# EAGLE design 16x16 (EAGLE 6.6.0)
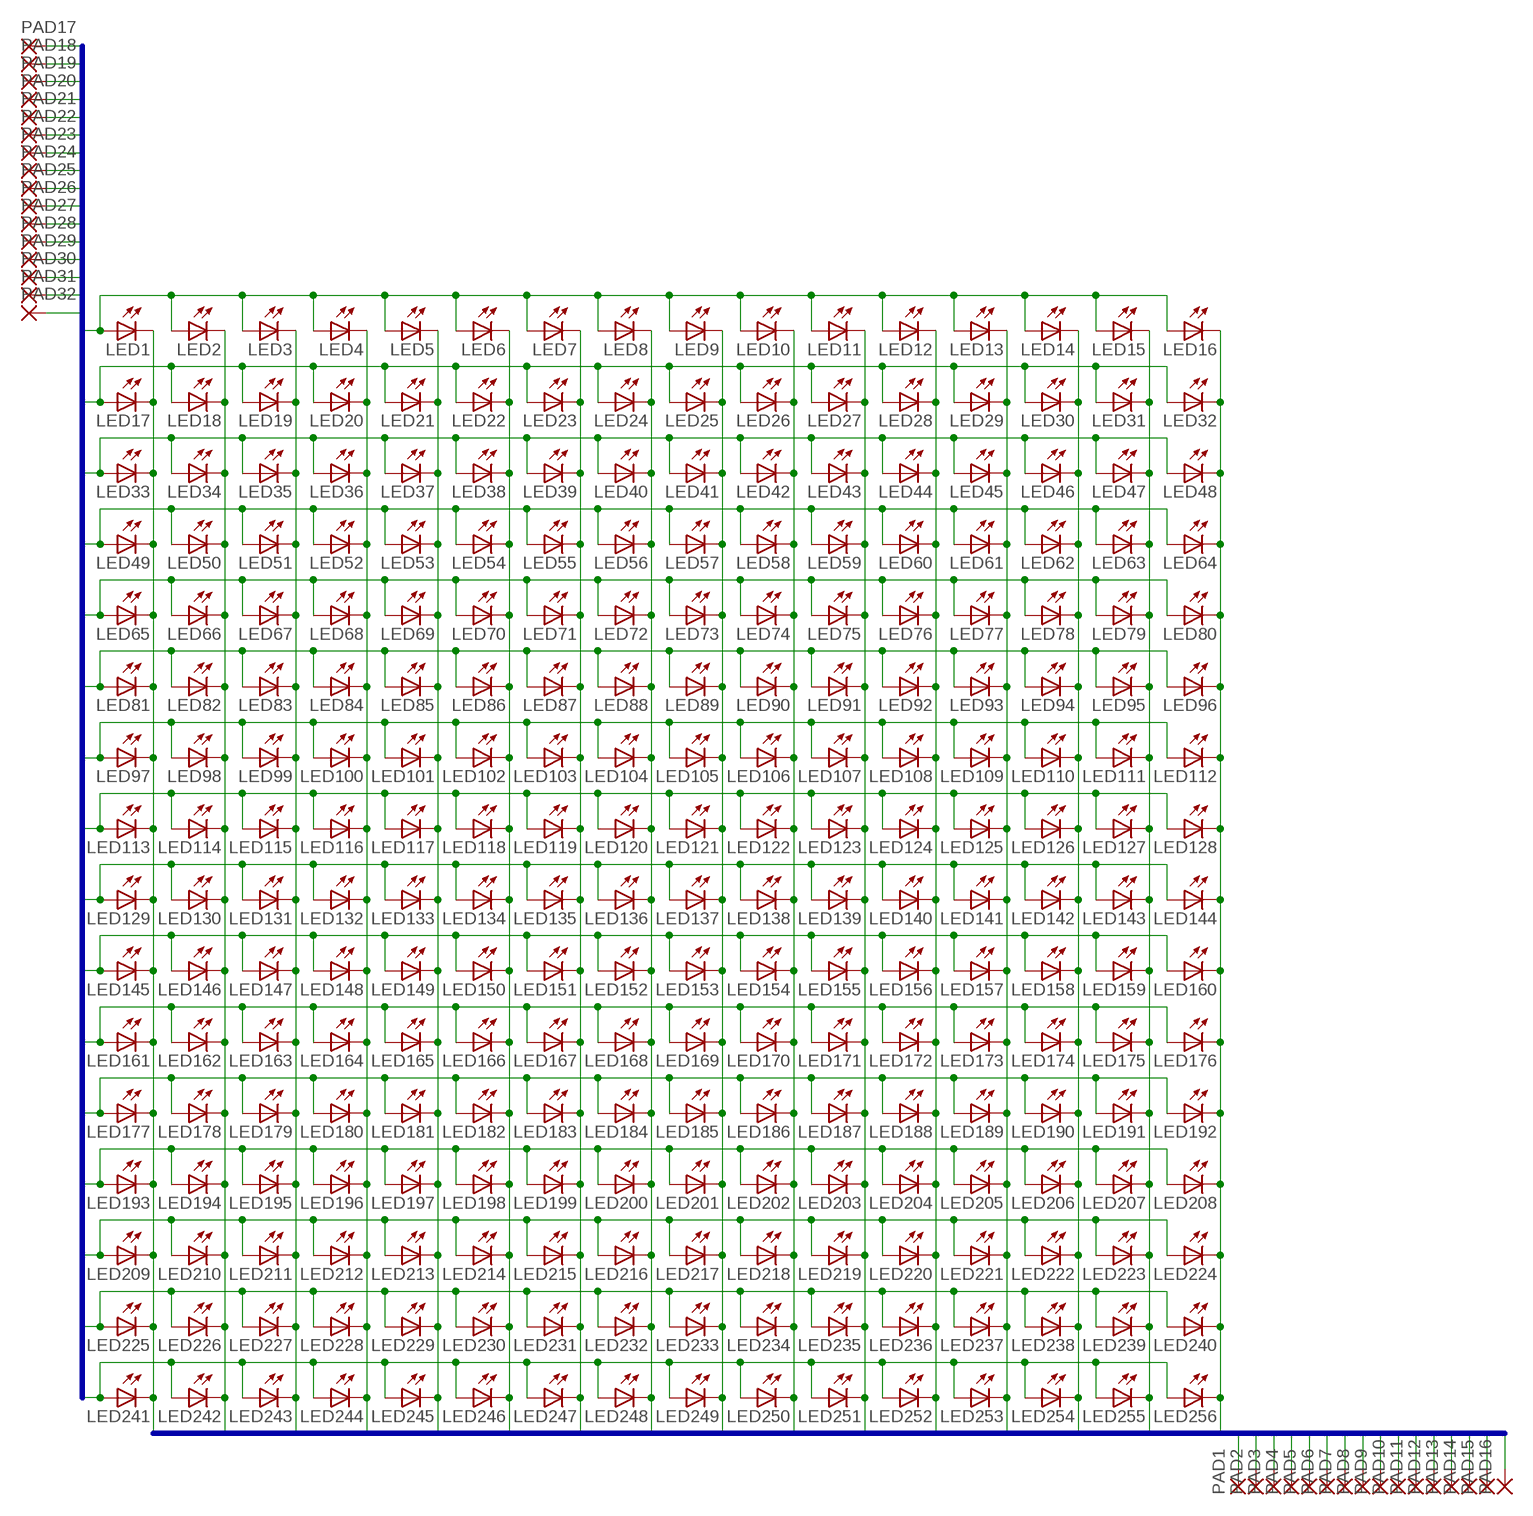
[diagram p0: schematic, sheet 1]

## Parts
LED1  LEDSML0603  [SML0603]
LED2  LEDSML0603  [SML0603]
LED3  LEDSML0603  [SML0603]
LED4  LEDSML0603  [SML0603]
LED5  LEDSML0603  [SML0603]
LED6  LEDSML0603  [SML0603]
LED7  LEDSML0603  [SML0603]
LED8  LEDSML0603  [SML0603]
LED9  LEDSML0603  [SML0603]
LED10  LEDSML0603  [SML0603]
LED11  LEDSML0603  [SML0603]
LED12  LEDSML0603  [SML0603]
LED13  LEDSML0603  [SML0603]
LED14  LEDSML0603  [SML0603]
LED15  LEDSML0603  [SML0603]
LED16  LEDSML0603  [SML0603]
LED17  LEDSML0603  [SML0603]
LED18  LEDSML0603  [SML0603]
LED19  LEDSML0603  [SML0603]
LED20  LEDSML0603  [SML0603]
LED21  LEDSML0603  [SML0603]
LED22  LEDSML0603  [SML0603]
LED23  LEDSML0603  [SML0603]
LED24  LEDSML0603  [SML0603]
LED25  LEDSML0603  [SML0603]
LED26  LEDSML0603  [SML0603]
LED27  LEDSML0603  [SML0603]
LED28  LEDSML0603  [SML0603]
LED29  LEDSML0603  [SML0603]
LED30  LEDSML0603  [SML0603]
LED31  LEDSML0603  [SML0603]
LED32  LEDSML0603  [SML0603]
LED33  LEDSML0603  [SML0603]
LED34  LEDSML0603  [SML0603]
LED35  LEDSML0603  [SML0603]
LED36  LEDSML0603  [SML0603]
LED37  LEDSML0603  [SML0603]
LED38  LEDSML0603  [SML0603]
LED39  LEDSML0603  [SML0603]
LED40  LEDSML0603  [SML0603]
LED41  LEDSML0603  [SML0603]
LED42  LEDSML0603  [SML0603]
LED43  LEDSML0603  [SML0603]
LED44  LEDSML0603  [SML0603]
LED45  LEDSML0603  [SML0603]
LED46  LEDSML0603  [SML0603]
LED47  LEDSML0603  [SML0603]
LED48  LEDSML0603  [SML0603]
LED49  LEDSML0603  [SML0603]
LED50  LEDSML0603  [SML0603]
LED51  LEDSML0603  [SML0603]
LED52  LEDSML0603  [SML0603]
LED53  LEDSML0603  [SML0603]
LED54  LEDSML0603  [SML0603]
LED55  LEDSML0603  [SML0603]
LED56  LEDSML0603  [SML0603]
LED57  LEDSML0603  [SML0603]
LED58  LEDSML0603  [SML0603]
LED59  LEDSML0603  [SML0603]
LED60  LEDSML0603  [SML0603]
LED61  LEDSML0603  [SML0603]
LED62  LEDSML0603  [SML0603]
LED63  LEDSML0603  [SML0603]
LED64  LEDSML0603  [SML0603]
LED65  LEDSML0603  [SML0603]
LED66  LEDSML0603  [SML0603]
LED67  LEDSML0603  [SML0603]
LED68  LEDSML0603  [SML0603]
LED69  LEDSML0603  [SML0603]
LED70  LEDSML0603  [SML0603]
LED71  LEDSML0603  [SML0603]
LED72  LEDSML0603  [SML0603]
LED73  LEDSML0603  [SML0603]
LED74  LEDSML0603  [SML0603]
LED75  LEDSML0603  [SML0603]
LED76  LEDSML0603  [SML0603]
LED77  LEDSML0603  [SML0603]
LED78  LEDSML0603  [SML0603]
LED79  LEDSML0603  [SML0603]
LED80  LEDSML0603  [SML0603]
LED81  LEDSML0603  [SML0603]
LED82  LEDSML0603  [SML0603]
LED83  LEDSML0603  [SML0603]
LED84  LEDSML0603  [SML0603]
LED85  LEDSML0603  [SML0603]
LED86  LEDSML0603  [SML0603]
LED87  LEDSML0603  [SML0603]
LED88  LEDSML0603  [SML0603]
LED89  LEDSML0603  [SML0603]
LED90  LEDSML0603  [SML0603]
LED91  LEDSML0603  [SML0603]
LED92  LEDSML0603  [SML0603]
LED93  LEDSML0603  [SML0603]
LED94  LEDSML0603  [SML0603]
LED95  LEDSML0603  [SML0603]
LED96  LEDSML0603  [SML0603]
LED97  LEDSML0603  [SML0603]
LED98  LEDSML0603  [SML0603]
LED99  LEDSML0603  [SML0603]
LED100  LEDSML0603  [SML0603]
LED101  LEDSML0603  [SML0603]
LED102  LEDSML0603  [SML0603]
LED103  LEDSML0603  [SML0603]
LED104  LEDSML0603  [SML0603]
LED105  LEDSML0603  [SML0603]
LED106  LEDSML0603  [SML0603]
LED107  LEDSML0603  [SML0603]
LED108  LEDSML0603  [SML0603]
LED109  LEDSML0603  [SML0603]
LED110  LEDSML0603  [SML0603]
LED111  LEDSML0603  [SML0603]
LED112  LEDSML0603  [SML0603]
LED113  LEDSML0603  [SML0603]
LED114  LEDSML0603  [SML0603]
LED115  LEDSML0603  [SML0603]
LED116  LEDSML0603  [SML0603]
LED117  LEDSML0603  [SML0603]
LED118  LEDSML0603  [SML0603]
LED119  LEDSML0603  [SML0603]
LED120  LEDSML0603  [SML0603]
LED121  LEDSML0603  [SML0603]
LED122  LEDSML0603  [SML0603]
LED123  LEDSML0603  [SML0603]
LED124  LEDSML0603  [SML0603]
LED125  LEDSML0603  [SML0603]
LED126  LEDSML0603  [SML0603]
LED127  LEDSML0603  [SML0603]
LED128  LEDSML0603  [SML0603]
LED129  LEDSML0603  [SML0603]
LED130  LEDSML0603  [SML0603]
LED131  LEDSML0603  [SML0603]
LED132  LEDSML0603  [SML0603]
LED133  LEDSML0603  [SML0603]
LED134  LEDSML0603  [SML0603]
LED135  LEDSML0603  [SML0603]
LED136  LEDSML0603  [SML0603]
LED137  LEDSML0603  [SML0603]
LED138  LEDSML0603  [SML0603]
LED139  LEDSML0603  [SML0603]
LED140  LEDSML0603  [SML0603]
LED141  LEDSML0603  [SML0603]
LED142  LEDSML0603  [SML0603]
LED143  LEDSML0603  [SML0603]
LED144  LEDSML0603  [SML0603]
LED145  LEDSML0603  [SML0603]
LED146  LEDSML0603  [SML0603]
LED147  LEDSML0603  [SML0603]
LED148  LEDSML0603  [SML0603]
LED149  LEDSML0603  [SML0603]
LED150  LEDSML0603  [SML0603]
LED151  LEDSML0603  [SML0603]
LED152  LEDSML0603  [SML0603]
LED153  LEDSML0603  [SML0603]
LED154  LEDSML0603  [SML0603]
LED155  LEDSML0603  [SML0603]
LED156  LEDSML0603  [SML0603]
LED157  LEDSML0603  [SML0603]
LED158  LEDSML0603  [SML0603]
LED159  LEDSML0603  [SML0603]
LED160  LEDSML0603  [SML0603]
LED161  LEDSML0603  [SML0603]
LED162  LEDSML0603  [SML0603]
LED163  LEDSML0603  [SML0603]
LED164  LEDSML0603  [SML0603]
LED165  LEDSML0603  [SML0603]
LED166  LEDSML0603  [SML0603]
LED167  LEDSML0603  [SML0603]
LED168  LEDSML0603  [SML0603]
LED169  LEDSML0603  [SML0603]
LED170  LEDSML0603  [SML0603]
LED171  LEDSML0603  [SML0603]
LED172  LEDSML0603  [SML0603]
LED173  LEDSML0603  [SML0603]
LED174  LEDSML0603  [SML0603]
LED175  LEDSML0603  [SML0603]
LED176  LEDSML0603  [SML0603]
LED177  LEDSML0603  [SML0603]
LED178  LEDSML0603  [SML0603]
LED179  LEDSML0603  [SML0603]
LED180  LEDSML0603  [SML0603]
LED181  LEDSML0603  [SML0603]
LED182  LEDSML0603  [SML0603]
LED183  LEDSML0603  [SML0603]
LED184  LEDSML0603  [SML0603]
LED185  LEDSML0603  [SML0603]
LED186  LEDSML0603  [SML0603]
LED187  LEDSML0603  [SML0603]
LED188  LEDSML0603  [SML0603]
LED189  LEDSML0603  [SML0603]
LED190  LEDSML0603  [SML0603]
LED191  LEDSML0603  [SML0603]
LED192  LEDSML0603  [SML0603]
LED193  LEDSML0603  [SML0603]
LED194  LEDSML0603  [SML0603]
LED195  LEDSML0603  [SML0603]
LED196  LEDSML0603  [SML0603]
LED197  LEDSML0603  [SML0603]
LED198  LEDSML0603  [SML0603]
LED199  LEDSML0603  [SML0603]
LED200  LEDSML0603  [SML0603]
LED201  LEDSML0603  [SML0603]
LED202  LEDSML0603  [SML0603]
LED203  LEDSML0603  [SML0603]
LED204  LEDSML0603  [SML0603]
LED205  LEDSML0603  [SML0603]
LED206  LEDSML0603  [SML0603]
LED207  LEDSML0603  [SML0603]
LED208  LEDSML0603  [SML0603]
LED209  LEDSML0603  [SML0603]
LED210  LEDSML0603  [SML0603]
LED211  LEDSML0603  [SML0603]
LED212  LEDSML0603  [SML0603]
LED213  LEDSML0603  [SML0603]
LED214  LEDSML0603  [SML0603]
LED215  LEDSML0603  [SML0603]
LED216  LEDSML0603  [SML0603]
LED217  LEDSML0603  [SML0603]
LED218  LEDSML0603  [SML0603]
LED219  LEDSML0603  [SML0603]
LED220  LEDSML0603  [SML0603]
LED221  LEDSML0603  [SML0603]
LED222  LEDSML0603  [SML0603]
LED223  LEDSML0603  [SML0603]
LED224  LEDSML0603  [SML0603]
LED225  LEDSML0603  [SML0603]
LED226  LEDSML0603  [SML0603]
LED227  LEDSML0603  [SML0603]
LED228  LEDSML0603  [SML0603]
LED229  LEDSML0603  [SML0603]
LED230  LEDSML0603  [SML0603]
LED231  LEDSML0603  [SML0603]
LED232  LEDSML0603  [SML0603]
LED233  LEDSML0603  [SML0603]
LED234  LEDSML0603  [SML0603]
LED235  LEDSML0603  [SML0603]
LED236  LEDSML0603  [SML0603]
LED237  LEDSML0603  [SML0603]
LED238  LEDSML0603  [SML0603]
LED239  LEDSML0603  [SML0603]
LED240  LEDSML0603  [SML0603]
LED241  LEDSML0603  [SML0603]
LED242  LEDSML0603  [SML0603]
LED243  LEDSML0603  [SML0603]
LED244  LEDSML0603  [SML0603]
LED245  LEDSML0603  [SML0603]
LED246  LEDSML0603  [SML0603]
LED247  LEDSML0603  [SML0603]
LED248  LEDSML0603  [SML0603]
LED249  LEDSML0603  [SML0603]
LED250  LEDSML0603  [SML0603]
LED251  LEDSML0603  [SML0603]
LED252  LEDSML0603  [SML0603]
LED253  LEDSML0603  [SML0603]
LED254  LEDSML0603  [SML0603]
LED255  LEDSML0603  [SML0603]
LED256  LEDSML0603  [SML0603]
PAD1  SMD2  [SMD1,27-2,54]
PAD2  SMD2  [SMD1,27-2,54]
PAD3  SMD2  [SMD1,27-2,54]
PAD4  SMD2  [SMD1,27-2,54]
PAD5  SMD2  [SMD1,27-2,54]
PAD6  SMD2  [SMD1,27-2,54]
PAD7  SMD2  [SMD1,27-2,54]
PAD8  SMD2  [SMD1,27-2,54]
PAD9  SMD2  [SMD1,27-2,54]
PAD10  SMD2  [SMD1,27-2,54]
PAD11  SMD2  [SMD1,27-2,54]
PAD12  SMD2  [SMD1,27-2,54]
PAD13  SMD2  [SMD1,27-2,54]
PAD14  SMD2  [SMD1,27-2,54]
PAD15  SMD2  [SMD1,27-2,54]
PAD16  SMD2  [SMD1,27-2,54]
PAD17  SMD2  [SMD1,27-2,54]
PAD18  SMD2  [SMD1,27-2,54]
PAD19  SMD2  [SMD1,27-2,54]
PAD20  SMD2  [SMD1,27-2,54]
PAD21  SMD2  [SMD1,27-2,54]
PAD22  SMD2  [SMD1,27-2,54]
PAD23  SMD2  [SMD1,27-2,54]
PAD24  SMD2  [SMD1,27-2,54]
PAD25  SMD2  [SMD1,27-2,54]
PAD26  SMD2  [SMD1,27-2,54]
PAD27  SMD2  [SMD1,27-2,54]
PAD28  SMD2  [SMD1,27-2,54]
PAD29  SMD2  [SMD1,27-2,54]
PAD30  SMD2  [SMD1,27-2,54]
PAD31  SMD2  [SMD1,27-2,54]
PAD32  SMD2  [SMD1,27-2,54]

## Nets
X0: LED1.C LED17.C LED33.C LED49.C LED65.C LED81.C LED97.C LED113.C LED129.C LED145.C LED161.C LED177.C LED193.C LED209.C LED225.C LED241.C PAD1.1(P)
X1: LED2.C LED18.C LED34.C LED50.C LED66.C LED82.C LED98.C LED114.C LED130.C LED146.C LED162.C LED178.C LED194.C LED210.C LED226.C LED242.C PAD2.1(P)
X2: LED3.C LED19.C LED35.C LED51.C LED67.C LED83.C LED99.C LED115.C LED131.C LED147.C LED163.C LED179.C LED195.C LED211.C LED227.C LED243.C PAD3.1(P)
X3: LED4.C LED20.C LED36.C LED52.C LED68.C LED84.C LED100.C LED116.C LED132.C LED148.C LED164.C LED180.C LED196.C LED212.C LED228.C LED244.C PAD4.1(P)
X4: LED5.C LED21.C LED37.C LED53.C LED69.C LED85.C LED101.C LED117.C LED133.C LED149.C LED165.C LED181.C LED197.C LED213.C LED229.C LED245.C PAD5.1(P)
X5: LED6.C LED22.C LED38.C LED54.C LED70.C LED86.C LED102.C LED118.C LED134.C LED150.C LED166.C LED182.C LED198.C LED214.C LED230.C LED246.C PAD6.1(P)
X6: LED7.C LED23.C LED39.C LED55.C LED71.C LED87.C LED103.C LED119.C LED135.C LED151.C LED167.C LED183.C LED199.C LED215.C LED231.C LED247.C PAD7.1(P)
X7: LED8.C LED24.C LED40.C LED56.C LED72.C LED88.C LED104.C LED120.C LED136.C LED152.C LED168.C LED184.C LED200.C LED216.C LED232.C LED248.C PAD8.1(P)
X8: LED9.C LED25.C LED41.C LED57.C LED73.C LED89.C LED105.C LED121.C LED137.C LED153.C LED169.C LED185.C LED201.C LED217.C LED233.C LED249.C PAD9.1(P)
X9: LED10.C LED26.C LED42.C LED58.C LED74.C LED90.C LED106.C LED122.C LED138.C LED154.C LED170.C LED186.C LED202.C LED218.C LED234.C LED250.C PAD10.1(P)
X10: LED11.C LED27.C LED43.C LED59.C LED75.C LED91.C LED107.C LED123.C LED139.C LED155.C LED171.C LED187.C LED203.C LED219.C LED235.C LED251.C PAD11.1(P)
X11: LED12.C LED28.C LED44.C LED60.C LED76.C LED92.C LED108.C LED124.C LED140.C LED156.C LED172.C LED188.C LED204.C LED220.C LED236.C LED252.C PAD12.1(P)
X12: LED13.C LED29.C LED45.C LED61.C LED77.C LED93.C LED109.C LED125.C LED141.C LED157.C LED173.C LED189.C LED205.C LED221.C LED237.C LED253.C PAD13.1(P)
X13: LED14.C LED30.C LED46.C LED62.C LED78.C LED94.C LED110.C LED126.C LED142.C LED158.C LED174.C LED190.C LED206.C LED222.C LED238.C LED254.C PAD14.1(P)
X14: LED15.C LED31.C LED47.C LED63.C LED79.C LED95.C LED111.C LED127.C LED143.C LED159.C LED175.C LED191.C LED207.C LED223.C LED239.C LED255.C PAD15.1(P)
X15: LED16.C LED32.C LED48.C LED64.C LED80.C LED96.C LED112.C LED128.C LED144.C LED160.C LED176.C LED192.C LED208.C LED224.C LED240.C LED256.C PAD16.1(P)
Y0: LED1.A LED2.A LED3.A LED4.A LED5.A LED6.A LED7.A LED8.A LED9.A LED10.A LED11.A LED12.A LED13.A LED14.A LED15.A LED16.A PAD17.1(P)
Y1: LED17.A LED18.A LED19.A LED20.A LED21.A LED22.A LED23.A LED24.A LED25.A LED26.A LED27.A LED28.A LED29.A LED30.A LED31.A LED32.A PAD18.1(P)
Y2: LED33.A LED34.A LED35.A LED36.A LED37.A LED38.A LED39.A LED40.A LED41.A LED42.A LED43.A LED44.A LED45.A LED46.A LED47.A LED48.A PAD19.1(P)
Y3: LED49.A LED50.A LED51.A LED52.A LED53.A LED54.A LED55.A LED56.A LED57.A LED58.A LED59.A LED60.A LED61.A LED62.A LED63.A LED64.A PAD20.1(P)
Y4: LED65.A LED66.A LED67.A LED68.A LED69.A LED70.A LED71.A LED72.A LED73.A LED74.A LED75.A LED76.A LED77.A LED78.A LED79.A LED80.A PAD21.1(P)
Y5: LED81.A LED82.A LED83.A LED84.A LED85.A LED86.A LED87.A LED88.A LED89.A LED90.A LED91.A LED92.A LED93.A LED94.A LED95.A LED96.A PAD22.1(P)
Y6: LED97.A LED98.A LED99.A LED100.A LED101.A LED102.A LED103.A LED104.A LED105.A LED106.A LED107.A LED108.A LED109.A LED110.A LED111.A LED112.A PAD23.1(P)
Y7: LED113.A LED114.A LED115.A LED116.A LED117.A LED118.A LED119.A LED120.A LED121.A LED122.A LED123.A LED124.A LED125.A LED126.A LED127.A LED128.A PAD24.1(P)
Y8: LED129.A LED130.A LED131.A LED132.A LED133.A LED134.A LED135.A LED136.A LED137.A LED138.A LED139.A LED140.A LED141.A LED142.A LED143.A LED144.A PAD25.1(P)
Y9: LED145.A LED146.A LED147.A LED148.A LED149.A LED150.A LED151.A LED152.A LED153.A LED154.A LED155.A LED156.A LED157.A LED158.A LED159.A LED160.A PAD26.1(P)
Y10: LED161.A LED162.A LED163.A LED164.A LED165.A LED166.A LED167.A LED168.A LED169.A LED170.A LED171.A LED172.A LED173.A LED174.A LED175.A LED176.A PAD27.1(P)
Y11: LED177.A LED178.A LED179.A LED180.A LED181.A LED182.A LED183.A LED184.A LED185.A LED186.A LED187.A LED188.A LED189.A LED190.A LED191.A LED192.A PAD28.1(P)
Y12: LED193.A LED194.A LED195.A LED196.A LED197.A LED198.A LED199.A LED200.A LED201.A LED202.A LED203.A LED204.A LED205.A LED206.A LED207.A LED208.A PAD29.1(P)
Y13: LED209.A LED210.A LED211.A LED212.A LED213.A LED214.A LED215.A LED216.A LED217.A LED218.A LED219.A LED220.A LED221.A LED222.A LED223.A LED224.A PAD30.1(P)
Y14: LED225.A LED226.A LED227.A LED228.A LED229.A LED230.A LED231.A LED232.A LED233.A LED234.A LED235.A LED236.A LED237.A LED238.A LED239.A LED240.A PAD31.1(P)
Y15: LED241.A LED242.A LED243.A LED244.A LED245.A LED246.A LED247.A LED248.A LED249.A LED250.A LED251.A LED252.A LED253.A LED254.A LED255.A LED256.A PAD32.1(P)

## Buses
X[0..15]
Y[0..15]

## Library data of the parts
LED1-LED256 = led:LED: LED OSRAM: - CHIPLED LG R971, LG N971, LY N971, LG Q971, LY Q971, LO R971, LY R971 LH N974, LH R974 LS Q976, LO Q976, LY Q976 LO Q996 - Hyper CHIPLED LW Q18S LB Q993, LB Q99A, LB R99A - SideLED LS A670, LO A670, LY A670, LG A670, LP A670 LB A673, LV A673, LT A673, LW A673 LH A674 LY A675 LS A676, LA A676, LO A676, LY A676, LW A676 LS A679, LY A679, LG A679 - Hyper Micro SIDELED® LS Y876, LA Y876, LO Y876, LY Y876 LT Y87S - SmartLED LW L88C, LW L88S LB L89C, LB L89S, LG L890 LS L89K, LO L89K, LY L89K LS L896, LA L896, LO L896, LY L896 - TOPLED LS T670, LO T670, LY T670, LG T670, LP T670 LSG T670, LSP T670, LSY T670, LOP T670, LYG T670 LG T671, LOG T671, LSG T671 LB T673, LV T673, LT T673, LW T673 LH T674 LS T676, LA T676, LO T676, LY T676, LB T676, LH T676, LSB T676, LW T676 LB T67C, LV T67C, LT T67C, LS T67K, LO T67K, LY T67K, LW E67C LS E67B, LA E67B, LO E67B, LY E67B, LB E67C, LV E67C, LT E67C LW T67C LS T679, LY T679, LG T679 LS T770, LO T770, LY T770, LG T770, LP T770 LB T773, LV T773, LT T773, LW T773 LH T774 LS E675, LA E675, LY E675, LS T675 LS T776, LA T776, LO T776, LY T776, LB T776 LHGB T686 LT T68C, LB T68C - Hyper Mini TOPLED® LB M676 - Mini TOPLED Santana® LG M470 LS M47K, LO M47K, LY M47K Source: http://www.osram.convergy.de LUXEON: - LUMILED® LXK2-PW12-R00, LXK2-PW12-S00, LXK2-PW14-U00, LXK2-PW14-V00 LXK2-PM12-R00, LXK2-PM12-S00, LXK2-PM14-U00 LXK2-PE12-Q00, LXK2-PE12-R00, LXK2-PE12-S00, LXK2-PE14-T00, LXK2-PE14-U00 LXK2-PB12-K00, LXK2-PB12-L00, LXK2-PB12-M00, LXK2-PB14-N00, LXK2-PB14-P00, LXK2-PB14-Q00 LXK2-PR12-L00, LXK2-PR12-M00, LXK2-PR14-Q00, LXK2-PR14-R00 LXK2-PD12-Q00, LXK2-PD12-R00, LXK2-PD12-S00 LXK2-PH12-R00, LXK2-PH12-S00 LXK2-PL12-P00, LXK2-PL12-Q00, LXK2-PL12-R00 Source: www.luxeon.com KINGBRIGHT: KA-3528ASYC Source: www.kingbright.com
PAD1-PAD32 = wirepad:SMD2: SMD PAD

## Board
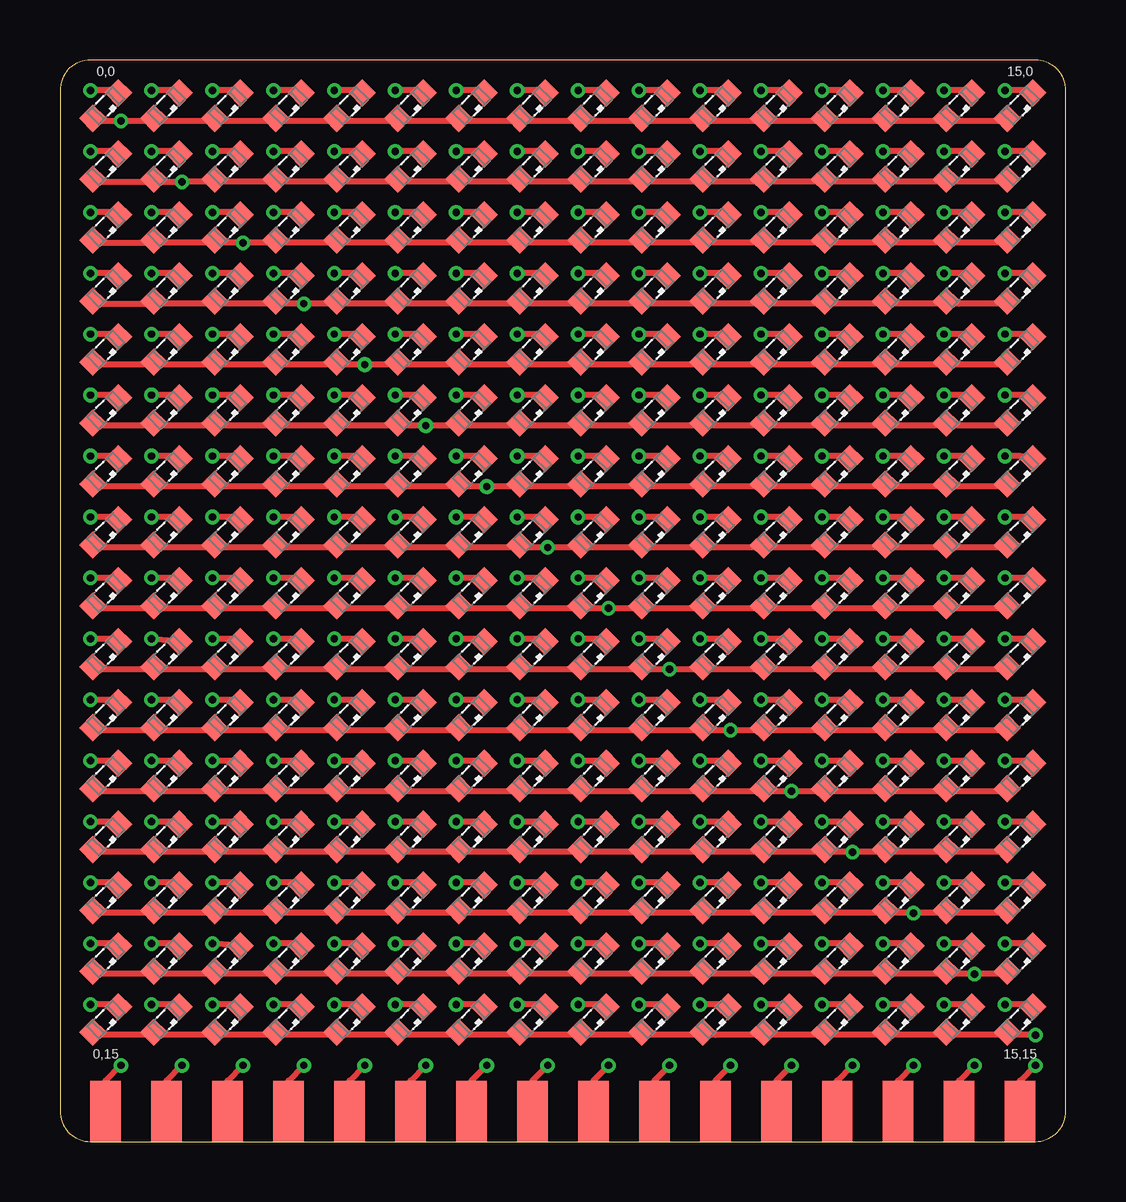
[diagram p1: board, top side]
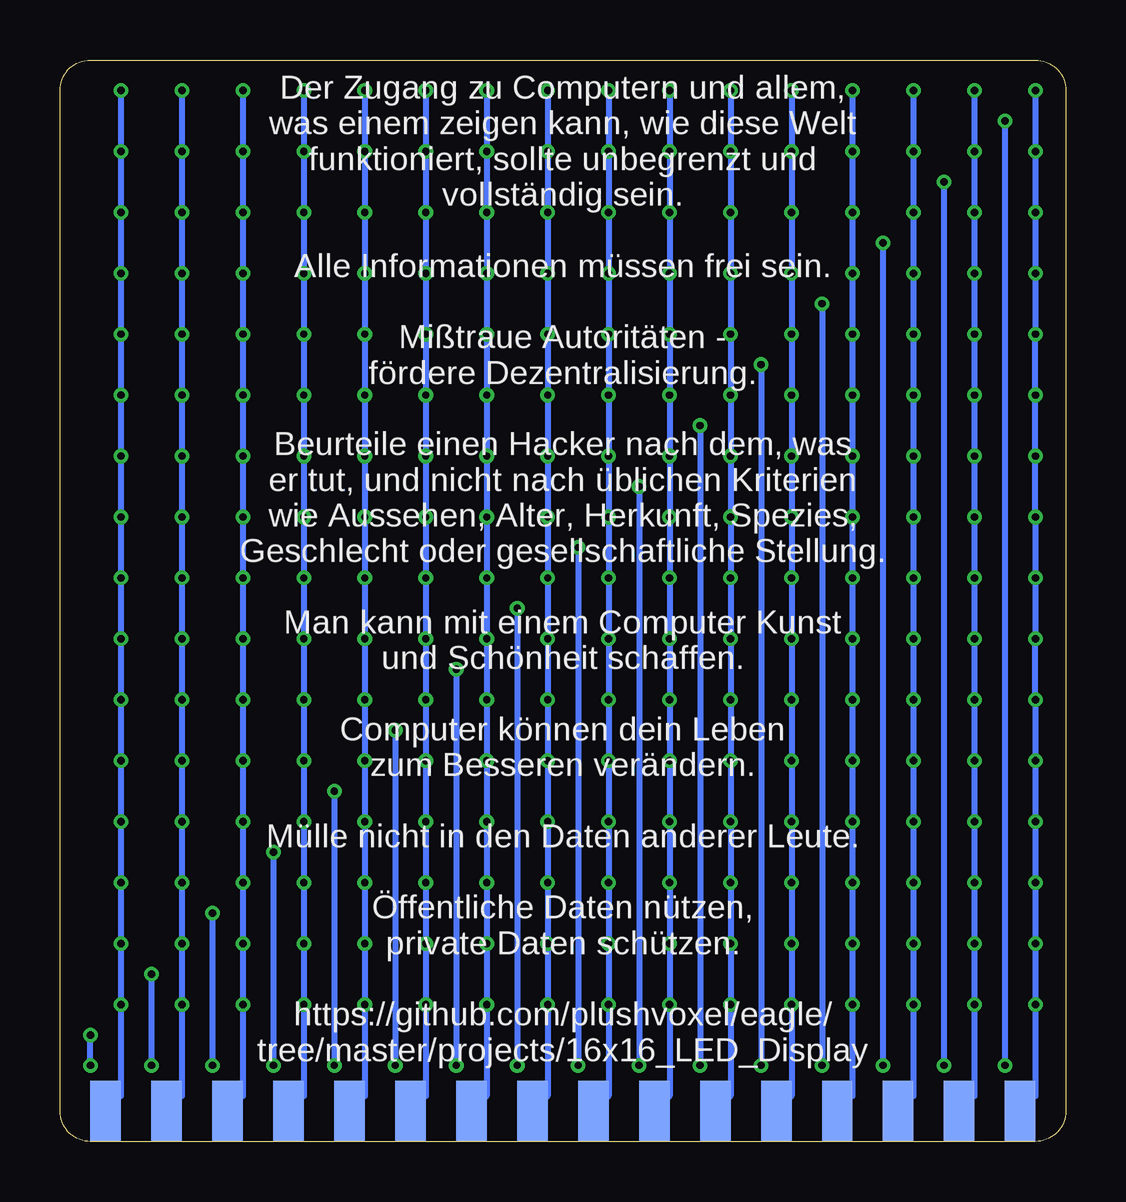
[diagram p2: board, bottom side, seen from below]

Size 41.91 x 45.09 mm. Coordinates in mm from the lower left corner, seen from the top.
Outline: 0,43.81 0,1.27 arc90 1.27,0 40.64,0 arc90 41.91,1.27 41.91,43.81 arc90 40.64,45.09 1.27,45.09 arc90 0,43.81
Copper layers (1*16): Top 0.035mm / dielectric 1.5mm / Bottom 0.035mm
Design rules "dirt_cheap_dirty_boards.v1": minimum track width 5mil, minimum drill 12mil, track to track 5mil, track to pad 5mil, pad to pad 5mil, via to via 5mil, smd to smd 0mil, copper to edge 10mil, drill to drill 10mil, minimum pad ring 10mil, minimum via ring 6mil, stop-mask expansion 2mil, vias tented up to drill 25mil, thermal gap 10mil

### Footprints (pad centres in the part's own frame; a part is rotated, then mirrored left to right if it is on the bottom)
SML0603 = smd 0.8 x 0.8: A 0.75,0; C -0.75,0
SMD1,27-2,54 = smd 1.27 x 2.54: 1 0,0

### Placement (x,y rotation side)
LED1  1.91,43.18 225 top
LED2  4.45,43.18 225 top
LED3  6.99,43.18 225 top
LED4  9.53,43.18 225 top
LED5  12.06,43.18 225 top
LED6  14.61,43.18 225 top
LED7  17.14,43.18 225 top
LED8  19.68,43.18 225 top
LED9  22.23,43.18 225 top
LED10  24.77,43.18 225 top
LED11  27.3,43.18 225 top
LED12  29.84,43.18 225 top
LED13  32.38,43.18 225 top
LED14  34.92,43.18 225 top
LED15  37.47,43.18 225 top
LED16  40.01,43.18 225 top
LED17  1.91,40.64 225 top
LED18  4.45,40.64 225 top
LED19  6.99,40.64 225 top
LED20  9.53,40.64 225 top
LED21  12.06,40.64 225 top
LED22  14.61,40.64 225 top
LED23  17.14,40.64 225 top
LED24  19.68,40.64 225 top
LED25  22.23,40.64 225 top
LED26  24.77,40.64 225 top
LED27  27.3,40.64 225 top
LED28  29.84,40.64 225 top
LED29  32.38,40.64 225 top
LED30  34.92,40.64 225 top
LED31  37.47,40.64 225 top
LED32  40.01,40.64 225 top
LED33  1.91,38.1 225 top
LED34  4.45,38.1 225 top
LED35  6.99,38.1 225 top
LED36  9.53,38.1 225 top
LED37  12.06,38.1 225 top
LED38  14.61,38.1 225 top
LED39  17.14,38.1 225 top
LED40  19.68,38.1 225 top
LED41  22.23,38.1 225 top
LED42  24.77,38.1 225 top
LED43  27.3,38.1 225 top
LED44  29.84,38.1 225 top
LED45  32.38,38.1 225 top
LED46  34.92,38.1 225 top
LED47  37.47,38.1 225 top
LED48  40.01,38.1 225 top
LED49  1.91,35.56 225 top
LED50  4.45,35.56 225 top
LED51  6.99,35.56 225 top
LED52  9.53,35.56 225 top
LED53  12.06,35.56 225 top
LED54  14.61,35.56 225 top
LED55  17.14,35.56 225 top
LED56  19.68,35.56 225 top
LED57  22.23,35.56 225 top
LED58  24.77,35.56 225 top
LED59  27.3,35.56 225 top
LED60  29.84,35.56 225 top
LED61  32.38,35.56 225 top
LED62  34.92,35.56 225 top
LED63  37.47,35.56 225 top
LED64  40.01,35.56 225 top
LED65  1.91,33.02 225 top
LED66  4.45,33.02 225 top
LED67  6.99,33.02 225 top
LED68  9.53,33.02 225 top
LED69  12.06,33.02 225 top
LED70  14.61,33.02 225 top
LED71  17.14,33.02 225 top
LED72  19.68,33.02 225 top
LED73  22.23,33.02 225 top
LED74  24.77,33.02 225 top
LED75  27.3,33.02 225 top
LED76  29.84,33.02 225 top
LED77  32.38,33.02 225 top
LED78  34.92,33.02 225 top
LED79  37.47,33.02 225 top
LED80  40.01,33.02 225 top
LED81  1.91,30.48 225 top
LED82  4.45,30.48 225 top
LED83  6.99,30.48 225 top
LED84  9.53,30.48 225 top
LED85  12.06,30.48 225 top
LED86  14.61,30.48 225 top
LED87  17.14,30.48 225 top
LED88  19.68,30.48 225 top
LED89  22.23,30.48 225 top
LED90  24.77,30.48 225 top
LED91  27.3,30.48 225 top
LED92  29.84,30.48 225 top
LED93  32.38,30.48 225 top
LED94  34.92,30.48 225 top
LED95  37.47,30.48 225 top
LED96  40.01,30.48 225 top
LED97  1.91,27.94 225 top
LED98  4.45,27.94 225 top
LED99  6.99,27.94 225 top
LED100  9.53,27.94 225 top
LED101  12.06,27.94 225 top
LED102  14.61,27.94 225 top
LED103  17.14,27.94 225 top
LED104  19.68,27.94 225 top
LED105  22.23,27.94 225 top
LED106  24.77,27.94 225 top
LED107  27.3,27.94 225 top
LED108  29.84,27.94 225 top
LED109  32.38,27.94 225 top
LED110  34.92,27.94 225 top
LED111  37.47,27.94 225 top
LED112  40.01,27.94 225 top
LED113  1.91,25.4 225 top
LED114  4.45,25.4 225 top
LED115  6.99,25.4 225 top
LED116  9.53,25.4 225 top
LED117  12.06,25.4 225 top
LED118  14.61,25.4 225 top
LED119  17.14,25.4 225 top
LED120  19.68,25.4 225 top
LED121  22.23,25.4 225 top
LED122  24.77,25.4 225 top
LED123  27.3,25.4 225 top
LED124  29.84,25.4 225 top
LED125  32.38,25.4 225 top
LED126  34.92,25.4 225 top
LED127  37.47,25.4 225 top
LED128  40.01,25.4 225 top
LED129  1.91,22.86 225 top
LED130  4.45,22.86 225 top
LED131  6.99,22.86 225 top
LED132  9.53,22.86 225 top
LED133  12.06,22.86 225 top
LED134  14.61,22.86 225 top
LED135  17.14,22.86 225 top
LED136  19.68,22.86 225 top
LED137  22.23,22.86 225 top
LED138  24.77,22.86 225 top
LED139  27.3,22.86 225 top
LED140  29.84,22.86 225 top
LED141  32.38,22.86 225 top
LED142  34.92,22.86 225 top
LED143  37.47,22.86 225 top
LED144  40.01,22.86 225 top
LED145  1.91,20.32 225 top
LED146  4.45,20.32 225 top
LED147  6.99,20.32 225 top
LED148  9.53,20.32 225 top
LED149  12.06,20.32 225 top
LED150  14.61,20.32 225 top
LED151  17.14,20.32 225 top
LED152  19.68,20.32 225 top
LED153  22.23,20.32 225 top
LED154  24.77,20.32 225 top
LED155  27.3,20.32 225 top
LED156  29.84,20.32 225 top
LED157  32.38,20.32 225 top
LED158  34.92,20.32 225 top
LED159  37.47,20.32 225 top
LED160  40.01,20.32 225 top
LED161  1.91,17.78 225 top
LED162  4.45,17.78 225 top
LED163  6.99,17.78 225 top
LED164  9.53,17.78 225 top
LED165  12.06,17.78 225 top
LED166  14.61,17.78 225 top
LED167  17.14,17.78 225 top
LED168  19.68,17.78 225 top
LED169  22.23,17.78 225 top
LED170  24.77,17.78 225 top
LED171  27.3,17.78 225 top
LED172  29.84,17.78 225 top
LED173  32.38,17.78 225 top
LED174  34.92,17.78 225 top
LED175  37.47,17.78 225 top
LED176  40.01,17.78 225 top
LED177  1.91,15.24 225 top
LED178  4.45,15.24 225 top
LED179  6.99,15.24 225 top
LED180  9.53,15.24 225 top
LED181  12.06,15.24 225 top
LED182  14.61,15.24 225 top
LED183  17.14,15.24 225 top
LED184  19.68,15.24 225 top
LED185  22.23,15.24 225 top
LED186  24.77,15.24 225 top
LED187  27.3,15.24 225 top
LED188  29.84,15.24 225 top
LED189  32.38,15.24 225 top
LED190  34.92,15.24 225 top
LED191  37.47,15.24 225 top
LED192  40.01,15.24 225 top
LED193  1.91,12.7 225 top
LED194  4.45,12.7 225 top
LED195  6.99,12.7 225 top
LED196  9.53,12.7 225 top
LED197  12.06,12.7 225 top
LED198  14.61,12.7 225 top
LED199  17.14,12.7 225 top
LED200  19.68,12.7 225 top
LED201  22.23,12.7 225 top
LED202  24.77,12.7 225 top
LED203  27.3,12.7 225 top
LED204  29.84,12.7 225 top
LED205  32.38,12.7 225 top
LED206  34.92,12.7 225 top
LED207  37.47,12.7 225 top
LED208  40.01,12.7 225 top
LED209  1.91,10.16 225 top
LED210  4.45,10.16 225 top
LED211  6.99,10.16 225 top
LED212  9.53,10.16 225 top
LED213  12.06,10.16 225 top
LED214  14.61,10.16 225 top
LED215  17.14,10.16 225 top
LED216  19.68,10.16 225 top
LED217  22.23,10.16 225 top
LED218  24.77,10.16 225 top
LED219  27.3,10.16 225 top
LED220  29.84,10.16 225 top
LED221  32.38,10.16 225 top
LED222  34.92,10.16 225 top
LED223  37.47,10.16 225 top
LED224  40.01,10.16 225 top
LED225  1.91,7.62 225 top
LED226  4.45,7.62 225 top
LED227  6.99,7.62 225 top
LED228  9.53,7.62 225 top
LED229  12.06,7.62 225 top
LED230  14.61,7.62 225 top
LED231  17.14,7.62 225 top
LED232  19.68,7.62 225 top
LED233  22.23,7.62 225 top
LED234  24.77,7.62 225 top
LED235  27.3,7.62 225 top
LED236  29.84,7.62 225 top
LED237  32.38,7.62 225 top
LED238  34.92,7.62 225 top
LED239  37.47,7.62 225 top
LED240  40.01,7.62 225 top
LED241  1.91,5.08 225 top
LED242  4.45,5.08 225 top
LED243  6.99,5.08 225 top
LED244  9.53,5.08 225 top
LED245  12.06,5.08 225 top
LED246  14.61,5.08 225 top
LED247  17.14,5.08 225 top
LED248  19.68,5.08 225 top
LED249  22.23,5.08 225 top
LED250  24.77,5.08 225 top
LED251  27.3,5.08 225 top
LED252  29.84,5.08 225 top
LED253  32.38,5.08 225 top
LED254  34.92,5.08 225 top
LED255  37.47,5.08 225 top
LED256  40.01,5.08 225 top
PAD1  1.91,1.27 0 bottom
PAD2  4.45,1.27 0 bottom
PAD3  6.99,1.27 0 bottom
PAD4  9.53,1.27 0 bottom
PAD5  12.06,1.27 0 bottom
PAD6  14.61,1.27 0 bottom
PAD7  17.14,1.27 0 bottom
PAD8  19.68,1.27 0 bottom
PAD9  22.23,1.27 0 bottom
PAD10  24.77,1.27 0 bottom
PAD11  27.3,1.27 0 bottom
PAD12  29.84,1.27 0 bottom
PAD13  32.38,1.27 0 bottom
PAD14  34.92,1.27 0 bottom
PAD15  37.47,1.27 0 bottom
PAD16  40.01,1.27 0 bottom
PAD17  1.91,1.27 180 top
PAD18  4.45,1.27 180 top
PAD19  6.99,1.27 180 top
PAD20  9.53,1.27 180 top
PAD21  12.06,1.27 180 top
PAD22  14.61,1.27 180 top
PAD23  17.14,1.27 180 top
PAD24  19.68,1.27 180 top
PAD25  22.23,1.27 180 top
PAD26  24.77,1.27 180 top
PAD27  27.3,1.27 180 top
PAD28  29.84,1.27 180 top
PAD29  32.38,1.27 180 top
PAD30  34.92,1.27 180 top
PAD31  37.47,1.27 180 top
PAD32  40.01,1.27 180 top

### Tracks (layer width: path | path; a pad name or v marks a point on that pad's centre or on a via)
X0  (via drill 0.3 pad 0.25)
  Top 0.254: LED241.C 2.54,5.71 v1.27,5.71 | LED225.C 2.54,8.26 v1.27,8.26 | LED17.C 2.54,41.27 v1.27,41.27 | LED1.C 2.54,43.81 v1.27,43.81 | LED33.C 2.54,38.73 v1.27,38.73 | LED49.C 2.54,36.2 v1.27,36.2 | LED65.C 2.54,33.66 v1.27,33.66 | LED81.C 2.54,31.11 v1.27,31.11 | LED97.C 2.54,28.57 v1.27,28.57 | LED113.C 2.54,26.04 v1.27,26.04 | LED129.C 2.54,23.5 v1.27,23.5 | LED145.C 2.54,20.95 v1.27,20.95 | LED161.C 2.54,18.41 v1.27,18.41 | LED177.C 2.54,15.88 v1.27,15.88 | LED193.C 2.54,13.34 v1.27,13.34 | LED209.C 2.54,10.79 v1.27,10.79
  Bottom 0.254: v1.27,43.81 v1.27,41.27 v1.27,38.73 v1.27,36.2 v1.27,33.66 v1.27,31.11 v1.27,28.57 v1.27,26.04 v1.27,23.5 v1.27,20.95 v1.27,18.41 v1.27,15.88 v1.27,13.34 v1.27,10.79 v1.27,8.26 v1.27,5.71 1.27,1.91 PAD1.1
X1  (via drill 0.3 pad 0.25)
  Top 0.254: LED2.C 5.08,43.81 v3.81,43.81 | LED18.C 5.08,41.27 v3.81,41.27 | LED34.C 5.08,38.73 v3.81,38.73 | LED50.C 5.08,36.2 v3.81,36.2 | LED66.C 5.08,33.66 v3.81,33.66 | LED82.C 5.08,31.11 v3.81,31.11 | LED98.C 5.08,28.57 v3.81,28.57 | LED114.C 5.08,26.04 v3.81,26.04 | LED130.C 5.08,23.5 v3.81,23.5 | LED146.C v3.81,20.95 | LED162.C 5.08,18.41 v3.81,18.41 | LED178.C 5.08,15.88 v3.81,15.88 | LED194.C 5.08,13.34 v3.81,13.34 | LED210.C 5.08,10.79 v3.81,10.79 | LED226.C 5.08,8.26 v3.81,8.26 | LED242.C 5.08,5.71 v3.81,5.71
  Bottom 0.254: v3.81,43.81 v3.81,41.27 v3.81,38.73 v3.81,36.2 v3.81,33.66 v3.81,31.11 v3.81,28.57 v3.81,26.04 v3.81,23.5 v3.81,20.95 v3.81,18.41 v3.81,15.88 v3.81,13.34 v3.81,10.79 v3.81,8.26 v3.81,5.71 3.81,1.91 PAD2.1
X2  (via drill 0.3 pad 0.25)
  Top 0.254: LED3.C 7.62,43.81 v6.35,43.81 | LED19.C 7.62,41.27 v6.35,41.27 | LED35.C 7.62,38.73 v6.35,38.73 | LED51.C 7.62,36.2 v6.35,36.2 | LED67.C 7.62,33.66 v6.35,33.66 | LED83.C 7.62,31.11 v6.35,31.11 | LED99.C 7.62,28.57 v6.35,28.57 | LED115.C 7.62,26.04 v6.35,26.04 | LED131.C 7.62,23.5 v6.35,23.5 | LED147.C 7.62,20.95 v6.35,20.95 | LED163.C 7.62,18.41 v6.35,18.41 | LED179.C 7.62,15.88 v6.35,15.88 | LED195.C 7.62,13.34 v6.35,13.34 | LED211.C 7.62,10.79 v6.35,10.79 | LED227.C v6.35,8.26 | LED243.C 7.62,5.71 v6.35,5.71
  Bottom 0.254: v6.35,43.81 v6.35,41.27 v6.35,38.73 v6.35,36.2 v6.35,33.66 v6.35,31.11 v6.35,28.57 v6.35,26.04 v6.35,23.5 v6.35,20.95 v6.35,18.41 v6.35,15.88 v6.35,13.34 v6.35,10.79 v6.35,8.26 v6.35,5.71 6.35,1.91 PAD3.1
X3  (via drill 0.3 pad 0.25)
  Top 0.254: LED4.C 10.16,43.81 v8.89,43.81 | LED20.C 10.16,41.27 v8.89,41.27 | LED36.C 10.16,38.73 v8.89,38.73 | LED52.C 10.16,36.2 v8.89,36.2 | LED68.C 10.16,33.66 v8.89,33.66 | LED84.C 10.16,31.11 v8.89,31.11 | LED100.C 10.16,28.57 v8.89,28.57 | LED116.C 10.16,26.04 v8.89,26.04 | LED132.C 10.16,23.5 v8.89,23.5 | LED148.C 10.16,20.95 v8.89,20.95 | LED164.C 10.16,18.41 v8.89,18.41 | LED180.C 10.16,15.88 v8.89,15.88 | LED196.C 10.16,13.34 v8.89,13.34 | LED212.C 10.16,10.79 v8.89,10.79 | LED228.C 10.16,8.26 v8.89,8.26 | LED244.C 10.16,5.71 v8.89,5.71
  Bottom 0.254: v8.89,43.81 v8.89,41.27 v8.89,38.73 v8.89,36.2 v8.89,33.66 v8.89,31.11 v8.89,28.57 v8.89,26.04 v8.89,23.5 v8.89,20.95 v8.89,18.41 v8.89,15.88 v8.89,13.34 v8.89,10.79 v8.89,8.26 v8.89,5.71 8.89,1.91 PAD4.1
X4  (via drill 0.3 pad 0.25)
  Top 0.254: LED5.C 12.7,43.81 v11.43,43.81 | LED21.C 12.7,41.27 v11.43,41.27 | LED37.C 12.7,38.73 v11.43,38.73 | LED53.C 12.7,36.2 v11.43,36.2 | LED69.C 12.7,33.66 v11.43,33.66 | LED85.C 12.7,31.11 v11.43,31.11 | LED101.C 12.7,28.57 v11.43,28.57 | LED117.C 12.7,26.04 v11.43,26.04 | LED133.C 12.7,23.5 v11.43,23.5 | LED149.C 12.7,20.95 v11.43,20.95 | LED165.C 12.7,18.41 v11.43,18.41 | LED181.C 12.7,15.88 v11.43,15.88 | LED197.C 12.7,13.34 v11.43,13.34 | LED213.C 12.7,10.79 v11.43,10.79 | LED229.C 12.7,8.26 v11.43,8.26 | LED245.C 12.7,5.71 v11.43,5.71
  Bottom 0.254: v11.43,43.81 v11.43,41.27 v11.43,38.73 v11.43,36.2 v11.43,33.66 v11.43,31.11 v11.43,28.57 v11.43,26.04 v11.43,23.5 v11.43,20.95 v11.43,18.41 v11.43,15.88 v11.43,13.34 v11.43,10.79 v11.43,8.26 v11.43,5.71 11.43,1.91 PAD5.1
X5  (via drill 0.3 pad 0.25)
  Top 0.254: LED6.C 15.24,43.81 v13.97,43.81 | LED22.C 15.24,41.27 v13.97,41.27 | LED38.C 15.24,38.73 v13.97,38.73 | LED54.C 15.24,36.2 v13.97,36.2 | LED70.C 15.24,33.66 v13.97,33.66 | LED86.C 15.24,31.11 v13.97,31.11 | LED102.C 15.24,28.57 v13.97,28.57 | LED118.C 15.24,26.04 v13.97,26.04 | LED134.C 15.24,23.5 v13.97,23.5 | LED150.C 15.24,20.95 v13.97,20.95 | LED166.C 15.24,18.41 v13.97,18.41 | LED182.C 15.24,15.88 v13.97,15.88 | LED198.C 15.24,13.34 v13.97,13.34 | LED214.C 15.24,10.79 v13.97,10.79 | LED230.C 15.24,8.26 v13.97,8.26 | LED246.C 15.24,5.71 v13.97,5.71
  Bottom 0.254: v13.97,43.81 v13.97,41.27 v13.97,38.73 v13.97,36.2 v13.97,33.66 v13.97,31.11 v13.97,28.57 v13.97,26.04 v13.97,23.5 v13.97,20.95 v13.97,18.41 v13.97,15.88 v13.97,13.34 v13.97,10.79 v13.97,8.26 v13.97,5.71 13.97,1.91 PAD6.1
X6  (via drill 0.3 pad 0.25)
  Top 0.254: LED7.C 17.78,43.81 v16.51,43.81 | LED23.C 17.78,41.27 v16.51,41.27 | LED39.C 17.78,38.73 v16.51,38.73 | LED55.C 17.78,36.2 v16.51,36.2 | LED71.C 17.78,33.66 v16.51,33.66 | LED87.C 17.78,31.11 v16.51,31.11 | LED103.C 17.78,28.57 v16.51,28.57 | LED119.C 17.78,26.04 v16.51,26.04 | LED135.C 17.78,23.5 v16.51,23.5 | LED151.C 17.78,20.95 v16.51,20.95 | LED167.C 17.78,18.41 v16.51,18.41 | LED183.C 17.78,15.88 v16.51,15.88 | LED199.C 17.78,13.34 v16.51,13.34 | LED215.C 17.78,10.79 v16.51,10.79 | LED231.C 17.78,8.26 v16.51,8.26 | LED247.C 17.78,5.71 v16.51,5.71
  Bottom 0.254: v16.51,43.81 v16.51,41.27 v16.51,38.73 v16.51,36.2 v16.51,33.66 v16.51,31.11 v16.51,28.57 v16.51,26.04 v16.51,23.5 v16.51,20.95 v16.51,18.41 v16.51,15.88 v16.51,13.34 v16.51,10.79 v16.51,8.26 v16.51,5.71 16.51,1.91 PAD7.1
X7  (via drill 0.3 pad 0.25)
  Top 0.254: LED8.C 20.32,43.81 v19.05,43.81 | LED24.C 20.32,41.27 v19.05,41.27 | LED40.C 20.32,38.73 v19.05,38.73 | LED56.C 20.32,36.2 v19.05,36.2 | LED72.C 20.32,33.66 v19.05,33.66 | LED88.C 20.32,31.11 v19.05,31.11 | LED104.C 20.32,28.57 v19.05,28.57 | LED120.C 20.32,26.04 v19.05,26.04 | LED136.C 20.32,23.5 v19.05,23.5 | LED152.C 20.32,20.95 v19.05,20.95 | LED168.C 20.32,18.41 v19.05,18.41 | LED184.C 20.32,15.88 v19.05,15.88 | LED200.C 20.32,13.34 v19.05,13.34 | LED216.C 20.32,10.79 v19.05,10.79 | LED232.C 20.32,8.26 v19.05,8.26 | LED248.C 20.32,5.71 v19.05,5.71
  Bottom 0.254: v19.05,43.81 v19.05,41.27 v19.05,38.73 v19.05,36.2 v19.05,33.66 v19.05,31.11 v19.05,28.57 v19.05,26.04 v19.05,23.5 v19.05,20.95 v19.05,18.41 v19.05,15.88 v19.05,13.34 v19.05,10.79 v19.05,8.26 v19.05,5.71 19.05,1.91 PAD8.1
X8  (via drill 0.3 pad 0.25)
  Top 0.254: LED9.C 22.86,43.81 v21.59,43.81 | LED25.C 22.86,41.27 v21.59,41.27 | LED41.C 22.86,38.73 v21.59,38.73 | LED57.C 22.86,36.2 v21.59,36.2 | LED73.C 22.86,33.66 v21.59,33.66 | LED89.C 22.86,31.11 v21.59,31.11 | LED105.C 22.86,28.57 v21.59,28.57 | LED121.C 22.86,26.04 v21.59,26.04 | LED137.C 22.86,23.5 v21.59,23.5 | LED153.C 22.86,20.95 v21.59,20.95 | LED169.C 22.86,18.41 v21.59,18.41 | LED185.C 22.86,15.88 v21.59,15.88 | LED201.C 22.86,13.34 v21.59,13.34 | LED217.C 22.86,10.79 v21.59,10.79 | LED233.C 22.86,8.26 v21.59,8.26 | LED249.C 22.86,5.71 v21.59,5.71
  Bottom 0.254: v21.59,43.81 v21.59,41.27 v21.59,38.73 v21.59,36.2 v21.59,33.66 v21.59,31.11 v21.59,28.57 v21.59,26.04 v21.59,23.5 v21.59,20.95 v21.59,18.41 v21.59,15.88 v21.59,13.34 v21.59,10.79 v21.59,8.26 v21.59,5.71 21.59,1.91 PAD9.1
X9  (via drill 0.3 pad 0.25)
  Top 0.254: LED10.C 25.4,43.81 v24.13,43.81 | LED26.C 25.4,41.27 v24.13,41.27 | LED42.C 25.4,38.73 v24.13,38.73 | LED58.C 25.4,36.2 v24.13,36.2 | LED74.C 25.4,33.66 v24.13,33.66 | LED90.C 25.4,31.11 v24.13,31.11 | LED106.C 25.4,28.57 v24.13,28.57 | LED122.C 25.4,26.04 v24.13,26.04 | LED138.C 25.4,23.5 v24.13,23.5 | LED154.C 25.4,20.95 v24.13,20.95 | LED170.C 25.4,18.41 v24.13,18.41 | LED186.C 25.4,15.88 v24.13,15.88 | LED202.C 25.4,13.34 v24.13,13.34 | LED218.C 25.4,10.79 v24.13,10.79 | LED234.C 25.4,8.26 v24.13,8.26 | LED250.C 25.4,5.71 v24.13,5.71
  Bottom 0.254: v24.13,43.81 v24.13,41.27 v24.13,38.73 v24.13,36.2 v24.13,33.66 v24.13,31.11 v24.13,28.57 v24.13,26.04 v24.13,23.5 v24.13,20.95 v24.13,18.41 v24.13,15.88 v24.13,13.34 v24.13,10.79 v24.13,8.26 v24.13,5.71 24.13,1.91 PAD10.1
X10  (via drill 0.3 pad 0.25)
  Top 0.254: LED11.C 27.94,43.81 v26.67,43.81 | LED27.C 27.94,41.27 v26.67,41.27 | LED43.C 27.94,38.73 v26.67,38.73 | LED59.C 27.94,36.2 v26.67,36.2 | LED75.C 27.94,33.66 v26.67,33.66 | LED91.C 27.94,31.11 v26.67,31.11 | LED107.C 27.94,28.57 v26.67,28.57 | LED123.C 27.94,26.04 v26.67,26.04 | LED139.C 27.94,23.5 v26.67,23.5 | LED155.C 27.94,20.95 v26.67,20.95 | LED171.C 27.94,18.41 v26.67,18.41 | LED187.C 27.94,15.88 v26.67,15.88 | LED203.C 27.94,13.34 v26.67,13.34 | LED219.C 27.94,10.79 v26.67,10.79 | LED235.C 27.94,8.26 v26.67,8.26 | LED251.C 27.94,5.71 v26.67,5.71
  Bottom 0.254: v26.67,43.81 v26.67,41.27 v26.67,38.73 v26.67,36.2 v26.67,33.66 v26.67,31.11 v26.67,28.57 v26.67,26.04 v26.67,23.5 v26.67,20.95 v26.67,18.41 v26.67,15.88 v26.67,13.34 v26.67,10.79 v26.67,8.26 v26.67,5.71 26.67,1.91 PAD11.1
X11  (via drill 0.3 pad 0.25)
  Top 0.254: LED12.C 30.48,43.81 v29.21,43.81 | LED28.C 30.48,41.27 v29.21,41.27 | LED44.C 30.48,38.73 v29.21,38.73 | LED60.C 30.48,36.2 v29.21,36.2 | LED76.C 30.48,33.66 v29.21,33.66 | LED92.C 30.48,31.11 v29.21,31.11 | LED108.C 30.48,28.57 v29.21,28.57 | LED124.C 30.48,26.04 v29.21,26.04 | LED140.C 30.48,23.5 v29.21,23.5 | LED156.C 30.48,20.95 v29.21,20.95 | LED172.C 30.48,18.41 v29.21,18.41 | LED188.C 30.48,15.88 v29.21,15.88 | LED204.C 30.48,13.34 v29.21,13.34 | LED220.C 30.48,10.79 v29.21,10.79 | LED236.C 30.48,8.26 v29.21,8.26 | LED252.C 30.48,5.71 v29.21,5.71
  Bottom 0.254: v29.21,43.81 v29.21,41.27 v29.21,38.73 v29.21,36.2 v29.21,33.66 v29.21,31.11 v29.21,28.57 v29.21,26.04 v29.21,23.5 v29.21,20.95 v29.21,18.41 v29.21,15.88 v29.21,13.34 v29.21,10.79 v29.21,8.26 v29.21,5.71 29.21,1.91 PAD12.1
X12  (via drill 0.3 pad 0.25)
  Top 0.254: LED13.C 33.02,43.81 v31.75,43.81 | LED29.C 33.02,41.27 v31.75,41.27 | LED45.C 33.02,38.73 v31.75,38.73 | LED61.C 33.02,36.2 v31.75,36.2 | LED77.C 33.02,33.66 v31.75,33.66 | LED93.C 33.02,31.11 v31.75,31.11 | LED109.C 33.02,28.57 v31.75,28.57 | LED125.C 33.02,26.04 v31.75,26.04 | LED141.C 33.02,23.5 v31.75,23.5 | LED157.C 33.02,20.95 v31.75,20.95 | LED173.C 33.02,18.41 v31.75,18.41 | LED189.C 33.02,15.88 v31.75,15.88 | LED205.C 33.02,13.34 v31.75,13.34 | LED221.C 33.02,10.79 v31.75,10.79 | LED237.C 33.02,8.26 v31.75,8.26 | LED253.C 33.02,5.71 v31.75,5.71
  Bottom 0.254: v31.75,43.81 v31.75,41.27 v31.75,38.73 v31.75,36.2 v31.75,33.66 v31.75,31.11 v31.75,28.57 v31.75,26.04 v31.75,23.5 v31.75,20.95 v31.75,18.41 v31.75,15.88 v31.75,13.34 v31.75,10.79 v31.75,8.26 v31.75,5.71 31.75,1.91 PAD13.1
X13  (via drill 0.3 pad 0.25)
  Top 0.254: LED14.C 35.56,43.81 v34.29,43.81 | LED30.C 35.56,41.27 v34.29,41.27 | LED46.C 35.56,38.73 v34.29,38.73 | LED62.C 35.56,36.2 v34.29,36.2 | LED78.C 35.56,33.66 v34.29,33.66 | LED94.C 35.56,31.11 v34.29,31.11 | LED110.C 35.56,28.57 v34.29,28.57 | LED126.C 35.56,26.04 v34.29,26.04 | LED142.C 35.56,23.5 v34.29,23.5 | LED158.C 35.56,20.95 v34.29,20.95 | LED174.C 35.56,18.41 v34.29,18.41 | LED190.C 35.56,15.88 v34.29,15.88 | LED206.C 35.56,13.34 v34.29,13.34 | LED222.C 35.56,10.79 v34.29,10.79 | LED238.C 35.56,8.26 v34.29,8.26 | LED254.C 35.56,5.71 v34.29,5.71
  Bottom 0.254: v34.29,43.81 v34.29,41.27 v34.29,38.73 v34.29,36.2 v34.29,33.66 v34.29,31.11 v34.29,28.57 v34.29,26.04 v34.29,23.5 v34.29,20.95 v34.29,18.41 v34.29,15.88 v34.29,13.34 v34.29,10.79 v34.29,8.26 v34.29,5.71 34.29,1.91 PAD14.1
X14  (via drill 0.3 pad 0.25)
  Top 0.254: LED15.C 38.1,43.81 v36.83,43.81 | LED31.C 38.1,41.27 v36.83,41.27 | LED47.C 38.1,38.73 v36.83,38.73 | LED63.C 38.1,36.2 v36.83,36.2 | LED79.C 38.1,33.66 v36.83,33.66 | LED95.C 38.1,31.11 v36.83,31.11 | LED111.C 38.1,28.57 v36.83,28.57 | LED127.C 38.1,26.04 v36.83,26.04 | LED143.C 38.1,23.5 v36.83,23.5 | LED159.C 38.1,20.95 v36.83,20.95 | LED175.C 38.1,18.41 v36.83,18.41 | LED191.C 38.1,15.88 v36.83,15.88 | LED207.C 38.1,13.34 v36.83,13.34 | LED223.C 38.1,10.79 v36.83,10.79 | LED239.C 38.1,8.26 v36.83,8.26 | LED255.C 38.1,5.71 v36.83,5.71
  Bottom 0.254: v36.83,43.81 v36.83,41.27 v36.83,38.73 v36.83,36.2 v36.83,33.66 v36.83,31.11 v36.83,28.57 v36.83,26.04 v36.83,23.5 v36.83,20.95 v36.83,18.41 v36.83,15.88 v36.83,13.34 v36.83,10.79 v36.83,8.26 v36.83,5.71 36.83,1.91 PAD15.1
X15  (via drill 0.3 pad 0.25)
  Top 0.254: LED16.C 40.64,43.81 v39.37,43.81 | LED32.C 40.64,41.27 v39.37,41.27 | LED48.C 40.64,38.73 v39.37,38.73 | LED64.C 40.64,36.2 v39.37,36.2 | LED80.C 40.64,33.66 v39.37,33.66 | LED96.C 40.64,31.11 v39.37,31.11 | LED112.C 40.01,28.57 v39.37,28.57 | LED128.C 40.64,26.04 v39.37,26.04 | LED144.C 40.64,23.5 v39.37,23.5 | LED160.C 40.64,20.95 v39.37,20.95 | LED176.C 40.64,18.41 v39.37,18.41 | LED192.C 40.64,15.88 v39.37,15.88 | LED208.C 40.64,13.34 v39.37,13.34 | LED224.C 40.64,10.79 v39.37,10.79 | LED240.C 40.64,8.26 v39.37,8.26 | LED256.C 40.64,5.71 v39.37,5.71
  Bottom 0.254: v39.37,43.81 v39.37,41.27 v39.37,38.73 v39.37,36.2 v39.37,33.66 v39.37,31.11 v39.37,28.57 v39.37,26.04 v39.37,23.5 v39.37,20.95 v39.37,18.41 v39.37,15.88 v39.37,13.34 v39.37,10.79 v39.37,8.26 v39.37,5.71 39.37,1.91 PAD16.1
Y0  (via drill 0.3 pad 0.25)
  Top 0.254: LED1.A 1.27,42.55 v2.54,42.55 3.81,42.55 | 3.81,42.55 6.35,42.55 | 6.35,42.55 8.89,42.55 | 8.89,42.55 11.43,42.55 | 11.43,42.55 13.97,42.55 | 13.97,42.55 16.51,42.55 | 16.51,42.55 19.05,42.55 | 19.05,42.55 21.59,42.55 | 21.59,42.55 24.13,42.55 | 24.13,42.55 26.67,42.55 | 26.67,42.55 29.21,42.55 | 29.21,42.55 31.75,42.55 | 31.75,42.55 34.29,42.55 | 34.29,42.55 36.83,42.55 | 36.83,42.55 39.37,42.55 LED16.A | LED15.A 36.83,42.55 | LED14.A 34.29,42.55 | LED2.A 3.81,42.55 | LED3.A 6.35,42.55 | LED4.A 8.89,42.55 | LED5.A 11.43,42.55 | LED6.A 13.97,42.55 | LED7.A 16.51,42.55 | LED8.A 19.05,42.55 | LED9.A 21.59,42.55 | LED10.A 24.13,42.55 | LED11.A 26.67,42.55 | LED12.A 29.21,42.55 | LED13.A 31.75,42.55 | v2.54,3.17 1.91,2.54 PAD17.1
  Bottom 0.254: v2.54,42.55 v2.54,3.17
Y1  (via drill 0.3 pad 0.25)
  Top 0.254: LED32.A 39.37,40.01 36.83,40.01 | 36.83,40.01 34.29,40.01 | 34.29,40.01 31.75,40.01 | 31.75,40.01 29.21,40.01 | 29.21,40.01 26.67,40.01 | 26.67,40.01 24.13,40.01 | 24.13,40.01 21.59,40.01 | 21.59,40.01 19.05,40.01 | 19.05,40.01 16.51,40.01 | 16.51,40.01 13.97,40.01 | 13.97,40.01 11.43,40.01 | 11.43,40.01 8.89,40.01 | 8.89,40.01 6.35,40.01 | 6.35,40.01 v5.08,40.01 3.81,40.01 | 3.81,40.01 1.27,40.01 LED17.A | LED18.A 3.81,40.01 | LED19.A 6.35,40.01 | LED20.A 8.89,40.01 | LED21.A 11.43,40.01 | LED22.A 13.97,40.01 | LED23.A 16.51,40.01 | LED24.A 19.05,40.01 | LED25.A 21.59,40.01 | LED26.A 24.13,40.01 | LED27.A 26.67,40.01 | LED28.A 29.21,40.01 | LED29.A 31.75,40.01 | LED30.A 34.29,40.01 | LED31.A 36.83,40.01 | v5.08,3.17 4.45,2.54 PAD18.1
  Bottom 0.254: v5.08,40.01 v5.08,3.17
Y2  (via drill 0.3 pad 0.25)
  Top 0.254: LED48.A 39.37,37.47 36.83,37.47 | 36.83,37.47 34.29,37.47 | 34.29,37.47 31.75,37.47 | 31.75,37.47 29.21,37.47 | 29.21,37.47 26.67,37.47 | 26.67,37.47 24.13,37.47 | 24.13,37.47 21.59,37.47 | 21.59,37.47 19.05,37.47 | 19.05,37.47 16.51,37.47 | 16.51,37.47 13.97,37.47 | 13.97,37.47 11.43,37.47 | 11.43,37.47 8.89,37.47 | 8.89,37.47 v7.62,37.47 6.35,37.47 | 6.35,37.47 3.81,37.47 | 3.81,37.47 1.27,37.47 LED33.A | LED34.A 3.81,37.47 | LED35.A 6.35,37.47 | LED36.A 8.89,37.47 | LED37.A 11.43,37.47 | LED38.A 13.97,37.47 | LED39.A 16.51,37.47 | LED40.A 19.05,37.47 | LED41.A 21.59,37.47 | LED42.A 24.13,37.47 | LED43.A 26.67,37.47 | LED44.A 29.21,37.47 | LED45.A 31.75,37.47 | LED46.A 34.29,37.47 | LED47.A 36.83,37.47 | PAD19.1 6.99,2.54 v7.62,3.17
  Bottom 0.254: v7.62,37.47 v7.62,3.17
Y3  (via drill 0.3 pad 0.25)
  Top 0.254: LED64.A 39.37,34.92 37.47,34.92 | 37.47,34.92 34.29,34.92 | 34.29,34.92 31.75,34.92 | 31.75,34.92 29.21,34.92 | 29.21,34.92 26.67,34.92 | 26.67,34.92 24.13,34.92 | 24.13,34.92 21.59,34.92 | 21.59,34.92 19.05,34.92 | 19.05,34.92 16.51,34.92 | 16.51,34.92 13.97,34.92 | 13.97,34.92 11.43,34.92 | 11.43,34.92 v10.16,34.92 8.89,34.92 | 8.89,34.92 6.35,34.92 | 6.35,34.92 3.81,34.92 | 3.81,34.92 1.27,34.92 LED49.A | LED50.A 3.81,34.92 | LED51.A 6.35,34.92 | LED52.A 8.89,34.92 | LED53.A 11.43,34.92 | LED54.A 13.97,34.92 | LED55.A 16.51,34.92 | LED56.A 19.05,34.92 | LED57.A 21.59,34.92 | LED58.A 24.13,34.92 | LED59.A 26.67,34.92 | LED60.A 29.21,34.92 | LED61.A 31.75,34.92 | LED62.A 34.29,34.92 | LED63.A 37.36,35.03 37.47,34.92 | PAD20.1 9.53,2.54 v10.16,3.17
  Bottom 0.254: v10.16,34.92 v10.16,3.17
Y4  (via drill 0.3 pad 0.25)
  Top 0.254: LED80.A 39.37,32.38 36.83,32.38 | 36.83,32.38 34.29,32.38 | 34.29,32.38 31.75,32.38 | 31.75,32.38 29.21,32.38 | 29.21,32.38 26.67,32.38 | 26.67,32.38 24.13,32.38 | 24.13,32.38 21.59,32.38 | 21.59,32.38 19.05,32.38 | 19.05,32.38 16.51,32.38 | 16.51,32.38 13.97,32.38 | 13.97,32.38 v12.7,32.38 11.43,32.38 | 11.43,32.38 8.89,32.38 | 8.89,32.38 6.35,32.38 | 6.35,32.38 3.81,32.38 | 3.81,32.38 1.27,32.38 LED65.A | LED66.A 3.81,32.38 | LED67.A 6.35,32.38 | LED68.A 8.89,32.38 | LED69.A 11.43,32.38 | LED70.A 13.97,32.38 | LED71.A 16.51,32.38 | LED72.A 19.05,32.38 | LED73.A 21.59,32.38 | LED74.A 24.13,32.38 | LED75.A 26.67,32.38 | LED76.A 29.21,32.38 | LED77.A 31.75,32.38 | LED78.A 34.29,32.38 | LED79.A 36.83,32.38 | PAD21.1 12.06,2.54 v12.7,3.17
  Bottom 0.254: v12.7,32.38 v12.7,3.17
Y5  (via drill 0.3 pad 0.25)
  Top 0.254: LED96.A 39.37,29.84 36.83,29.84 | 36.83,29.84 34.29,29.84 | 34.29,29.84 31.75,29.84 | 31.75,29.84 29.21,29.84 | 29.21,29.84 26.67,29.84 | 26.67,29.84 24.13,29.84 | 24.13,29.84 21.59,29.84 | 21.59,29.84 19.05,29.84 | 19.05,29.84 16.51,29.84 | 16.51,29.84 v15.24,29.84 13.97,29.84 | 13.97,29.84 11.43,29.84 | 11.43,29.84 8.89,29.84 | 8.89,29.84 6.35,29.84 | 6.35,29.84 3.81,29.84 | 3.81,29.84 1.27,29.84 LED81.A | LED82.A 3.81,29.84 | LED83.A 6.35,29.84 | LED84.A 8.89,29.84 | LED85.A 11.43,29.84 | LED86.A 13.97,29.84 | LED87.A 16.51,29.84 | LED88.A 19.05,29.84 | LED89.A 21.59,29.84 | LED90.A 24.13,29.84 | LED91.A 26.67,29.84 | LED92.A 29.21,29.84 | LED93.A 31.75,29.84 | LED94.A 34.29,29.84 | LED95.A 36.83,29.84 | PAD22.1 14.61,2.54 v15.24,3.17
  Bottom 0.254: v15.24,29.84 v15.24,3.17
Y6  (via drill 0.3 pad 0.25)
  Top 0.254: LED112.A 39.37,27.3 36.83,27.3 | 36.83,27.3 34.92,27.3 | 34.92,27.3 31.75,27.3 | 31.75,27.3 29.21,27.3 | 29.21,27.3 26.67,27.3 | 26.67,27.3 24.13,27.3 | 24.13,27.3 21.59,27.3 | 21.59,27.3 19.05,27.3 | 19.05,27.3 v17.78,27.3 16.51,27.3 | 16.51,27.3 13.97,27.3 | 13.97,27.3 11.43,27.3 | 11.43,27.3 8.89,27.3 | 8.89,27.3 6.35,27.3 | 6.35,27.3 3.81,27.3 | 3.81,27.3 1.27,27.3 LED97.A | LED98.A 3.81,27.3 | LED99.A 6.35,27.3 | LED100.A 8.89,27.3 | LED101.A 11.43,27.3 | LED102.A 13.97,27.3 | LED103.A 16.51,27.3 | LED104.A 19.05,27.3 | LED105.A 21.59,27.3 | LED106.A 24.13,27.3 | LED107.A 26.67,27.3 | LED108.A 29.21,27.3 | LED109.A 31.75,27.3 | LED110.A 34.82,27.41 34.92,27.3 | LED111.A 36.83,27.3 | PAD23.1 17.14,2.54 v17.78,3.17
  Bottom 0.254: v17.78,27.3 v17.78,3.17
Y7  (via drill 0.3 pad 0.25)
  Top 0.254: LED128.A 39.37,24.77 36.83,24.77 | 36.83,24.77 34.29,24.77 | 34.29,24.77 31.75,24.77 | 31.75,24.77 29.21,24.77 | 29.21,24.77 26.67,24.77 | 26.67,24.77 24.13,24.77 | 24.13,24.77 21.59,24.77 | 21.59,24.77 v20.32,24.77 19.05,24.77 | 19.05,24.77 16.51,24.77 | 16.51,24.77 13.97,24.77 | 13.97,24.77 11.43,24.77 | 11.43,24.77 8.89,24.77 | 8.89,24.77 6.35,24.77 | 6.35,24.77 3.81,24.77 | 3.81,24.77 1.27,24.77 LED113.A | LED114.A 3.81,24.77 | LED115.A 6.35,24.77 | LED116.A 8.89,24.77 | LED117.A 11.43,24.77 | LED118.A 13.97,24.77 | LED119.A 16.51,24.77 | LED120.A 19.05,24.77 | LED121.A 21.59,24.77 | LED122.A 24.13,24.77 | LED123.A 26.67,24.77 | LED124.A 29.21,24.77 | LED125.A 31.75,24.77 | LED126.A 34.29,24.77 | LED127.A 36.83,24.77 | PAD24.1 19.68,2.54 v20.32,3.17
  Bottom 0.254: v20.32,24.77 v20.32,3.17
Y8  (via drill 0.3 pad 0.25)
  Top 0.254: LED144.A 39.37,22.23 36.83,22.23 | 36.83,22.23 34.29,22.23 | 34.29,22.23 31.75,22.23 | 31.75,22.23 29.21,22.23 | 29.21,22.23 26.67,22.23 | 26.67,22.23 24.13,22.23 | 24.13,22.23 v22.86,22.23 21.59,22.23 | 21.59,22.23 19.05,22.23 | 19.05,22.23 16.51,22.23 | 16.51,22.23 13.97,22.23 | 13.97,22.23 11.43,22.23 | 11.43,22.23 8.89,22.23 | 8.89,22.23 6.35,22.23 | 6.35,22.23 3.81,22.23 | 3.81,22.23 1.27,22.23 LED129.A | LED130.A 3.81,22.23 | LED131.A 6.35,22.23 | LED132.A 8.89,22.23 | LED133.A 11.43,22.23 | LED134.A 13.97,22.23 | LED135.A 16.51,22.23 | LED136.A 19.05,22.23 | LED137.A 21.59,22.23 | LED138.A 24.13,22.23 | LED139.A 26.67,22.23 | LED140.A 29.21,22.23 | LED141.A 31.75,22.23 | LED142.A 34.29,22.23 | LED143.A 36.83,22.23 | PAD25.1 22.23,2.54 v22.86,3.17
  Bottom 0.254: v22.86,22.23 v22.86,3.17
Y9  (via drill 0.3 pad 0.25)
  Top 0.254: LED160.A 39.37,19.68 36.83,19.68 | 36.83,19.68 34.29,19.68 | 34.29,19.68 31.75,19.68 | 31.75,19.68 29.21,19.68 | 29.21,19.68 26.67,19.68 | 26.67,19.68 v25.4,19.68 24.13,19.68 | 24.13,19.68 21.59,19.68 | 21.59,19.68 19.05,19.68 | 19.05,19.68 16.51,19.68 | 16.51,19.68 13.97,19.68 | 13.97,19.68 11.43,19.68 | 11.43,19.68 8.89,19.68 | 8.89,19.68 6.35,19.68 | 6.35,19.68 3.81,19.68 | 3.81,19.68 1.27,19.68 LED145.A | LED146.A 3.81,19.68 | LED147.A 6.35,19.68 | LED148.A 8.89,19.68 | LED149.A 11.43,19.68 | LED150.A 13.97,19.68 | LED151.A 16.51,19.68 | LED152.A 19.05,19.68 | LED153.A 21.59,19.68 | LED154.A 24.13,19.68 | LED155.A 26.67,19.68 | LED156.A 29.21,19.68 | LED157.A 31.75,19.68 | LED158.A 34.29,19.68 | LED159.A 36.83,19.68 | PAD26.1 24.77,2.54 v25.4,3.17
  Bottom 0.254: v25.4,19.68 v25.4,3.17
Y10  (via drill 0.3 pad 0.25)
  Top 0.254: LED176.A 39.37,17.14 36.83,17.14 | 36.83,17.14 34.29,17.14 | 34.29,17.14 31.75,17.14 | 31.75,17.14 29.21,17.14 | 29.21,17.14 v27.94,17.14 26.67,17.14 | 26.67,17.14 24.13,17.14 | 24.13,17.14 21.59,17.14 | 21.59,17.14 19.05,17.14 | 19.05,17.14 16.51,17.14 | 16.51,17.14 13.97,17.14 | 13.97,17.14 11.43,17.14 | 11.43,17.14 8.89,17.14 | 8.89,17.14 6.35,17.14 | 6.35,17.14 3.81,17.14 | 3.81,17.14 1.27,17.14 LED161.A | LED162.A 3.81,17.14 | LED163.A 6.35,17.14 | LED164.A 8.89,17.14 | LED165.A 11.43,17.14 | LED166.A 13.97,17.14 | LED167.A 16.51,17.14 | LED168.A 19.05,17.14 | LED169.A 21.59,17.14 | LED170.A 24.13,17.14 | LED171.A 26.67,17.14 | LED172.A 29.21,17.14 | LED173.A 31.75,17.14 | LED174.A 34.29,17.14 | LED175.A 36.83,17.14 | PAD27.1 27.3,2.54 v27.94,3.17
  Bottom 0.254: v27.94,17.14 v27.94,3.17
Y11  (via drill 0.3 pad 0.25)
  Top 0.254: LED192.A 39.37,14.61 36.83,14.61 | 36.83,14.61 34.29,14.61 | 34.29,14.61 31.75,14.61 | 31.75,14.61 v30.48,14.61 29.21,14.61 | 29.21,14.61 26.67,14.61 | 26.67,14.61 24.13,14.61 | 24.13,14.61 21.59,14.61 | 21.59,14.61 19.05,14.61 | 19.05,14.61 16.51,14.61 | 16.51,14.61 13.97,14.61 | 13.97,14.61 11.43,14.61 | 11.43,14.61 8.89,14.61 | 8.89,14.61 6.35,14.61 | 6.35,14.61 3.81,14.61 | 3.81,14.61 1.27,14.61 LED177.A | LED178.A 3.81,14.61 | LED179.A 6.35,14.61 | LED180.A 8.89,14.61 | LED181.A 11.43,14.61 | LED182.A 13.97,14.61 | LED183.A 16.51,14.61 | LED184.A 19.05,14.61 | LED185.A 21.59,14.61 | LED186.A 24.13,14.61 | LED187.A 26.67,14.61 | LED188.A 29.21,14.61 | LED189.A 31.75,14.61 | LED190.A 34.29,14.61 | LED191.A 36.83,14.61 | PAD28.1 29.84,2.54 v30.48,3.17
  Bottom 0.254: v30.48,14.61 v30.48,3.17
Y12  (via drill 0.3 pad 0.25)
  Top 0.254: LED208.A 39.37,12.06 36.83,12.06 | 36.83,12.06 34.29,12.06 | 34.29,12.06 v33.02,12.06 31.75,12.06 | 31.75,12.06 29.21,12.06 | 29.21,12.06 26.67,12.06 | 26.67,12.06 24.13,12.06 | 24.13,12.06 21.59,12.06 | 21.59,12.06 19.05,12.06 | 19.05,12.06 16.51,12.06 | 16.51,12.06 13.97,12.06 | 13.97,12.06 11.43,12.06 | 11.43,12.06 8.89,12.06 | 8.89,12.06 6.35,12.06 | 6.35,12.06 3.81,12.06 | 3.81,12.06 1.27,12.06 LED193.A | LED194.A 3.81,12.06 | LED195.A 6.35,12.06 | LED196.A 8.89,12.06 | LED197.A 11.43,12.06 | LED198.A 13.97,12.06 | LED199.A 16.51,12.06 | LED200.A 19.05,12.06 | LED201.A 21.59,12.06 | LED202.A 24.13,12.06 | LED203.A 26.67,12.06 | LED204.A 29.21,12.06 | LED205.A 31.75,12.06 | LED206.A 34.29,12.06 | LED207.A 36.83,12.06 | PAD29.1 32.38,2.54 v33.02,3.17
  Bottom 0.254: v33.02,12.06 v33.02,3.17
Y13  (via drill 0.3 pad 0.25)
  Top 0.254: LED224.A 39.37,9.53 36.83,9.53 | 36.83,9.53 v35.56,9.53 34.29,9.53 | 34.29,9.53 31.75,9.53 | 31.75,9.53 29.21,9.53 | 29.21,9.53 26.67,9.53 | 26.67,9.53 24.13,9.53 | 24.13,9.53 21.59,9.53 | 21.59,9.53 19.05,9.53 | 19.05,9.53 16.51,9.53 | 16.51,9.53 13.97,9.53 | 13.97,9.53 11.43,9.53 | 11.43,9.53 8.89,9.53 | 8.89,9.53 6.35,9.53 | 6.35,9.53 3.81,9.53 | 3.81,9.53 1.27,9.53 LED209.A | LED223.A 36.83,9.53 | LED222.A 34.29,9.53 | LED221.A 31.75,9.53 | LED210.A 3.81,9.53 | LED211.A 6.35,9.53 | LED212.A 8.89,9.53 | LED213.A 11.43,9.53 | LED214.A 13.97,9.53 | LED215.A 16.51,9.53 | LED216.A 19.05,9.53 | LED217.A 21.59,9.53 | LED218.A 24.13,9.53 | LED219.A 26.67,9.53 | LED220.A 29.21,9.53 | PAD30.1 34.92,2.54 v35.56,3.17
  Bottom 0.254: v35.56,9.53 v35.56,3.17
Y14  (via drill 0.3 pad 0.25)
  Top 0.254: LED240.A 39.37,6.99 v38.1,6.99 36.83,6.99 | 36.83,6.99 34.29,6.99 | 34.29,6.99 31.75,6.99 | 31.75,6.99 29.21,6.99 | 29.21,6.99 26.67,6.99 | 26.67,6.99 24.13,6.99 | 24.13,6.99 21.59,6.99 | 21.59,6.99 19.05,6.99 | 19.05,6.99 16.51,6.99 | 16.51,6.99 13.97,6.99 | 13.97,6.99 11.43,6.99 | 11.43,6.99 8.89,6.99 | 8.89,6.99 6.35,6.99 | 6.35,6.99 3.81,6.99 | 3.81,6.99 1.27,6.99 LED225.A | LED226.A 3.81,6.99 | LED227.A 6.35,6.99 | LED228.A 8.89,6.99 | LED229.A 11.43,6.99 | LED230.A 13.97,6.99 | LED231.A 16.51,6.99 | LED232.A 19.05,6.99 | LED233.A 21.59,6.99 | LED234.A 24.13,6.99 | LED235.A 26.67,6.99 | LED236.A 29.21,6.99 | LED237.A 31.75,6.99 | LED238.A 34.29,6.99 | LED239.A 36.83,6.99 | PAD31.1 37.47,2.54 v38.1,3.17
  Bottom 0.254: v38.1,6.99 v38.1,3.17
Y15  (via drill 0.3 pad 0.25)
  Top 0.254: 36.83,4.45 39.37,4.45 LED256.A 39.58,4.45 v40.64,4.45 | 36.83,4.45 34.29,4.45 | 34.29,4.45 31.75,4.45 | 31.75,4.45 29.21,4.45 | 29.21,4.45 27.3,4.45 | 27.3,4.45 24.13,4.45 | 24.13,4.45 21.59,4.45 | 21.59,4.45 19.05,4.45 | 19.05,4.45 16.51,4.45 | 16.51,4.45 13.97,4.45 | 13.97,4.45 11.43,4.45 | 11.43,4.45 8.89,4.45 | 8.89,4.45 6.35,4.45 | 6.35,4.45 3.81,4.45 | 3.81,4.45 1.27,4.45 LED241.A | LED255.A 36.83,4.45 | LED254.A 34.29,4.45 | LED253.A 31.75,4.45 | LED242.A 3.81,4.45 | LED243.A 6.35,4.45 | LED244.A 8.89,4.45 | LED245.A 11.43,4.45 | LED246.A 13.97,4.45 | LED247.A 16.51,4.45 | LED248.A 19.05,4.45 | LED249.A 21.59,4.45 | LED250.A 24.13,4.45 | LED251.A 27.2,4.55 27.3,4.45 | LED252.A 29.21,4.45 | PAD32.1 40.01,2.54 v40.64,3.17
  Bottom 0.254: v40.64,3.17 v40.64,4.45

### Text on the board
tNames: 0,0 | 15,0 | 0,15 | 15,15
bNames: Der Zugang zu Computern und allem, / was einem zeigen kann, wie diese Welt / funktioniert, sollte unbegrenzt und / vollständig sein. / / Alle Informationen müssen frei sein. / / Mißtraue Autoritäten - / fördere Dezentralisierung. / / Beurteile einen Hacker nach dem, was / er tut, und nicht nach üblichen Kriterien / wie Aussehen, Alter, Herkunft, Spezies, / Geschlecht oder gesellschaftliche Stellung. / / Man kann mit einem Computer Kunst / und Schönheit schaffen. / / Computer können dein Leben / zum Besseren verändern. / / Mülle nicht in den Daten anderer Leute. / / Öffentliche Daten nützen, / private Daten schützen. / / https://github.com/plushvoxel/eagle/ / tree/master/projects/16x16_LED_Display